# EAGLE design peregrine (EAGLE 6.2)
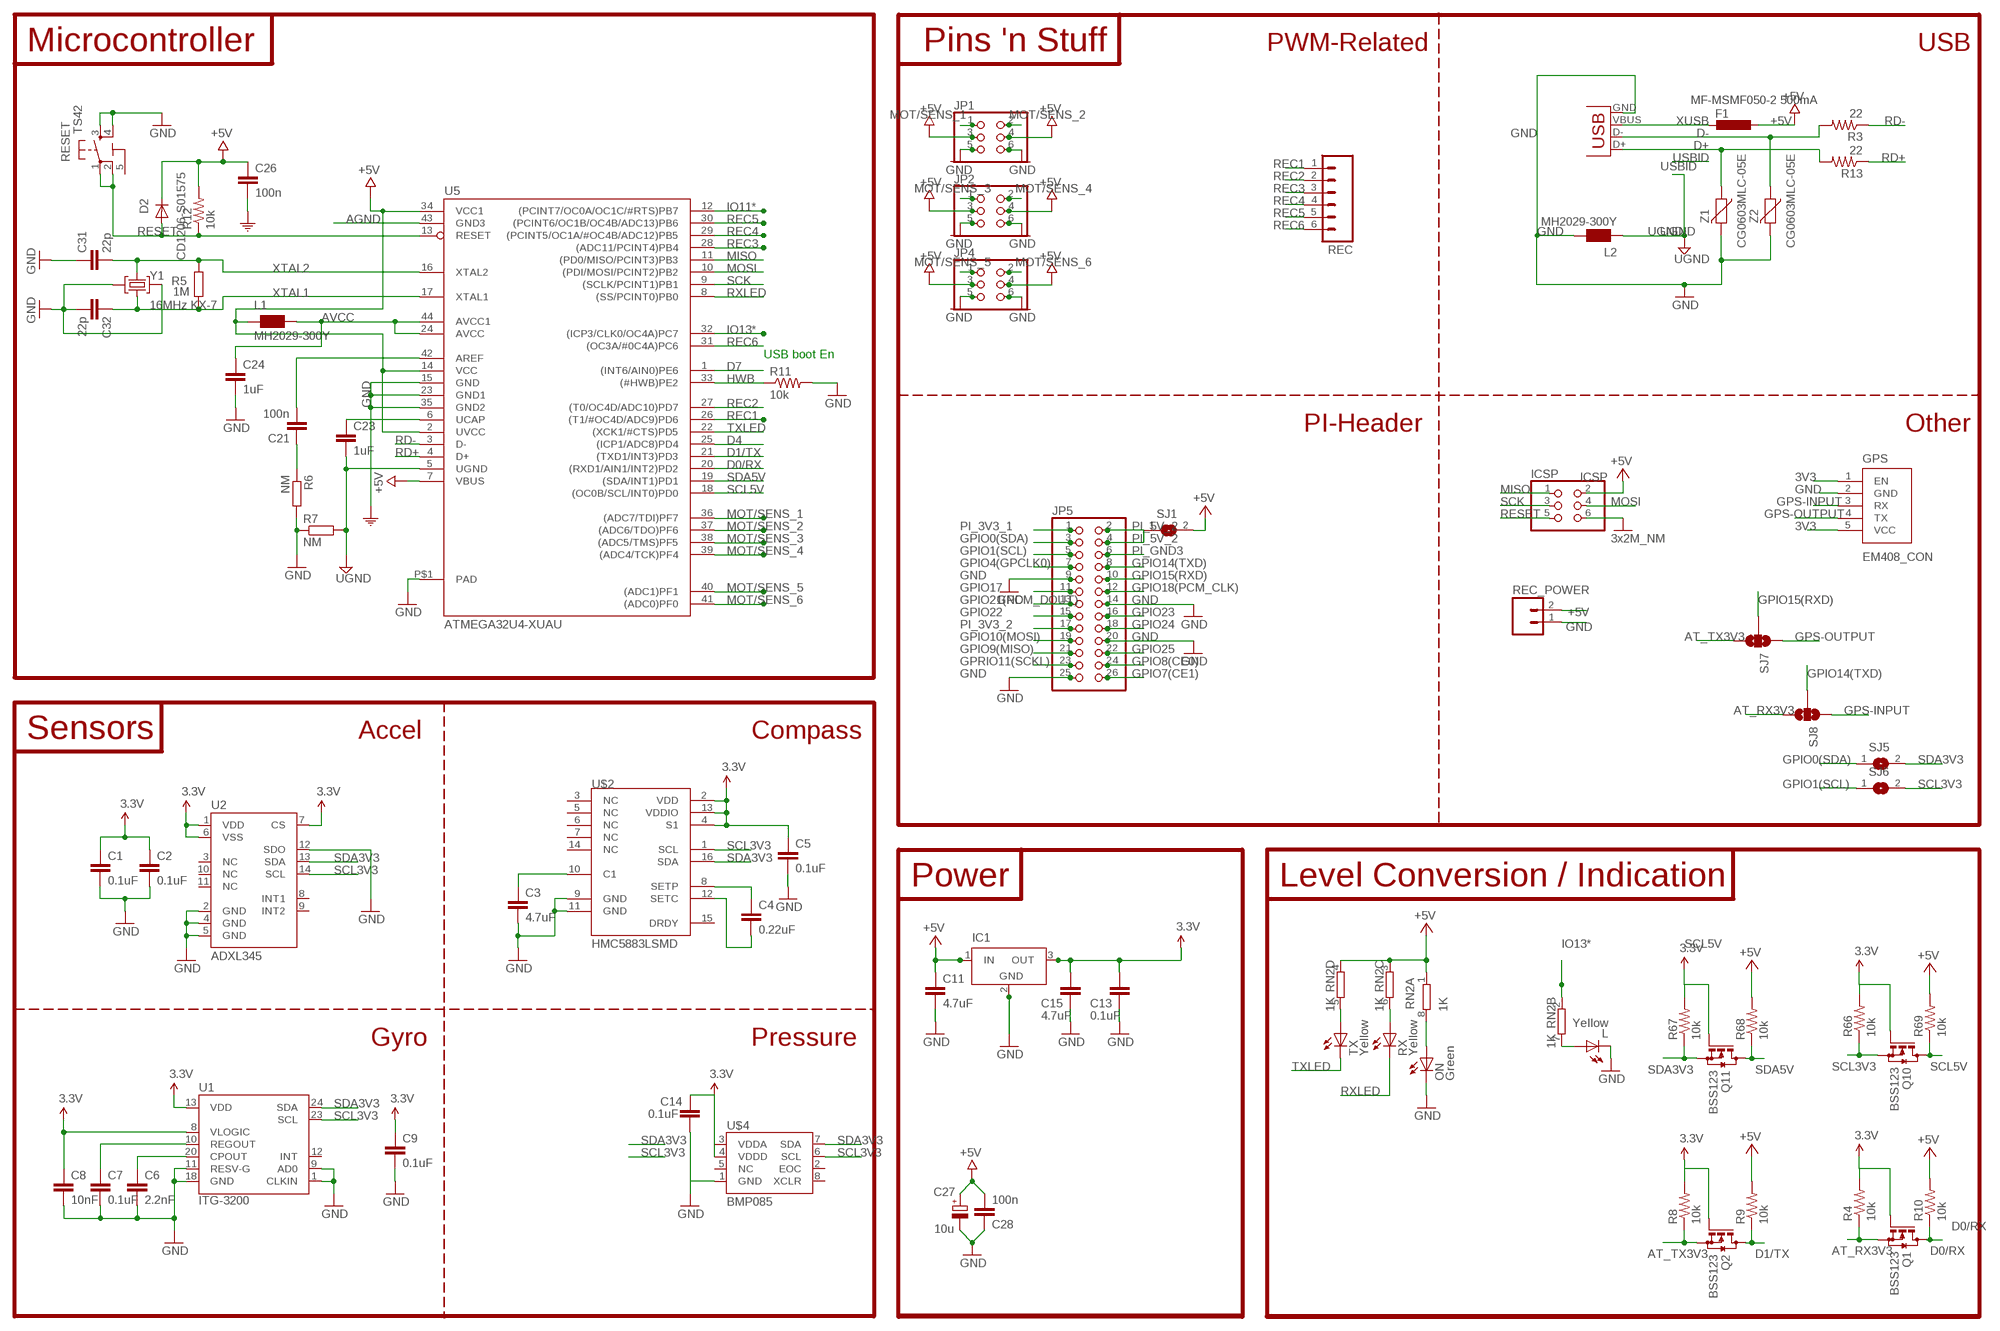
[diagram p0: schematic, sheet 1]

## Parts
C1  0.1uF  CAP0402-CAP  [0402-CAP]
C2  0.1uF  CAP0402-CAP  [0402-CAP]
C3  4.7uF  CAP0402-CAP  [0402-CAP]
C4  0.22uF  CAP0402-CAP  [0402-CAP]
C5  0.1uF  CAP0402-CAP  [0402-CAP]
C6  2.2nF  CAP0402-CAP  [0402-CAP]
C7  0.1uF  CAP0402-CAP  [0402-CAP]
C8  10nF  CAP0402-CAP  [0402-CAP]
C9  0.1uF  CAP0402-CAP  [0402-CAP]
C11  4.7uF  CAP0402-CAP  [0402-CAP]
C13  0.1uF  CAP0402-CAP  [0402-CAP]
C14  0.1uF  CAP0402-CAP  [0402-CAP]
C15  4.7uF  CAP0402-CAP  [0402-CAP]
C21  100n  C-EUC0603  [C0603-ROUND]
C23  1uF  C-EUC0603  [C0603-ROUND]
C24  1uF  C-EUC0603  [C0603-ROUND]
C26  100n  C-EUC0603  [C0603-ROUND]
C27  10u  CPOL-EUSMCB  [SMC_B]
C28  100n  C-EUC0603  [C0603-ROUND]
C31  22p  C-EUC0603  [C0603-ROUND]
C32  22p  C-EUC0603  [C0603-ROUND]
D2  CD1206-S01575  DIODE-MINIMELF  [MINIMELF]
F1  MF-MSMF050-2 500mA  L-EUL1812  [L1812]
GPS  EM408_CON  [EM408_CON]
IC1  LT1129CST5  [SOT223]
ICSP  ICSP  PINHD-2X3  [2X03]
JP1  PINHD-2X3  [2X03]
JP2  PINHD-2X3  [2X03]
JP4  PINHD-2X3  [2X03]
JP5  PINHD-2X13  [2X13]
L  Yellow  LEDCHIPLED_0805  [CHIPLED_0805]
L1  MH2029-300Y  WE-CBF_0805  [0805]
L2  MH2029-300Y  WE-CBF_0805  [0805]
ON  Green  LEDCHIPLED_0805  [CHIPLED_0805]
Q1  BSS123  [SOT23]
Q2  BSS123  [SOT23]
Q10  BSS123  [SOT23]
Q11  BSS123  [SOT23]
R3  22  RESISTOR0603-RES  [0603-RES]
R4  10k  RESISTOR0603-RES  [0603-RES]
R5  1M  R-EU_R0603  [R0603-ROUND]
R6  NM  R-EU_R0603  [R0603-ROUND]
R7  NM  R-EU_R0603  [R0603-ROUND]
R8  10k  RESISTOR0603-RES  [0603-RES]
R9  10k  RESISTOR0603-RES  [0603-RES]
R10  10k  RESISTOR0603-RES  [0603-RES]
R11  10k  R-US_R0603  [R0603]
R12  10k  R-US_R0603  [R0603]
R13  22  RESISTOR0603-RES  [0603-RES]
R66  10k  RESISTOR0603-RES  [0603-RES]
R67  10k  RESISTOR0603-RES  [0603-RES]
R68  10k  RESISTOR0603-RES  [0603-RES]
R69  10k  RESISTOR0603-RES  [0603-RES]
REC  M06SIP  [1X06]
REC_POWER  M02PTH  [1X02]
RESET  TS42  [TS42]
RN2  1K  4R-NCAY16  [CAY16]
RX  Yellow  LEDCHIPLED_0805  [CHIPLED_0805]
SJ1  SJ  [SJ]
SJ5  SJ  [SJ]
SJ6  SJ  [SJ]
SJ7  SOLDERJUMPER_2WAYS  [SJ_3]
SJ8  SOLDERJUMPER_2WAYS  [SJ_3]
TX  Yellow  LEDCHIPLED_0805  [CHIPLED_0805]
U1  ITG-3200  [QFN-24]
U2  ADXL345  [LGA14]
U5  ATMEGA32U4-XUAU  [TQFP44-PAD]
U$2  HMC5883LSMD  [16LPCC]
U$4  BMP085  [BMP085]
X2  USB-MICROB  [USB-MICROB]
Y1  16MHz KX-7  CRYSTAL-3.2-2.5  [CRYSTAL-3.2-2.5]
Z1  CG0603MLC-05E  VARISTORCN0603  [CT/CN0603]
Z2  CG0603MLC-05E  VARISTORCN0603  [CT/CN0603]

## Nets
3V3: C1.1 C2.1 C5.1 C8.1 C9.1 C13.1 C14.1 C15.1 GPS.1(EN) GPS.5(VCC) IC1.3(OUT) Q1.1(G) Q2.1(G) Q10.1(G) Q11.1(G) R4.2 R8.2 R66.2 R67.2 U1.8(VLOGIC) U1.13(VDD) U2.1(VDD) U2.6(VSS) U2.7(CS) U$2.2(VDD) U$2.4(S1) U$2.13(VDDIO) U$4.3(VDDA) U$4.4(VDDD) ; supply symbol labelled 3.3V
+5V: C11.1 C26.1 C27.+ C28.2 D2.C F1.1 IC1.1(IN) ICSP.2 JP1.3 JP1.4 JP2.3 JP2.4 JP4.3 JP4.4 L1.1 R9.2 R10.2 R12.2 R68.2 R69.2 REC_POWER.2 RN2.1 RN2.3 RN2.4 SJ1.2 U5.2(UVCC) U5.7(VBUS) U5.14(VCC) U5.34(VCC1)
AGND: C21.1 R6.1 U5.43(GND3)
AREF: C21.2 U5.42(AREF)
AT_RX3V3: Q1.2(S) R4.1 SJ8.3
AT_TX3V3: Q2.2(S) R8.1 SJ7.3
AVCC: C24.1 L1.2 U5.24(AVCC) U5.44(AVCC1)
D0/RX: Q1.3(D) R10.1 U5.20((RXD1/AIN1/INT2)PD2)
D1/TX: Q2.3(D) R9.1 U5.21((TXD1/INT3)PD3)
D4: U5.25((ICP1/ADC8)PD4)
D7: U5.1((INT6/AIN0)PE6)
D+: R13.2 X2.D+ Z1.1
D-: R3.2 X2.D- Z2.1
GND: C1.2 C2.2 C3.2 C5.2 C6.2 C7.2 C8.2 C9.2 C11.2 C13.2 C14.2 C15.2 C24.2 C26.2 C27.- C28.1 C31.1 C32.2 GPS.2(GND) IC1.2(GND) ICSP.6 JP1.5 JP1.6 JP2.5 JP2.6 JP4.5 JP4.6 JP5.9 JP5.14 JP5.20 JP5.25 L2.2 L.C ON.C R6.2 R7.1 R11.2 REC_POWER.1 RESET.3 RESET.4 U1.1(CLKIN) U1.9(AD0) U1.11(RESV-G) U1.18(GND) U2.2(GND) U2.4(GND) U2.5(GND) U2.12(SDO) U5.15(GND) U5.23(GND1) U5.35(GND2) U5.P$1(PAD) U$2.9(GND) U$2.11(GND) U$4.1(GND) X2.GND Y1.2(GND) Y1.4(GND) Z1.2 Z2.2 ; supply symbol labelled 3x2M_NM, COM
GPIO0(SDA): JP5.3 SJ5.1
GPIO1(SCL): JP5.5 SJ6.1
GPIO4(GPCLK0): JP5.7
GPIO7(CE1): JP5.26
GPIO8(CE0): JP5.24
GPIO9(MISO): JP5.21
GPIO10(MOSI): JP5.19
GPIO14(TXD): JP5.8 SJ8.2
GPIO15(RXD): JP5.10 SJ7.2
GPIO17: JP5.11
GPIO18(PCM_CLK): JP5.12
GPIO21(PCM_DOUT): JP5.13
GPIO22: JP5.15
GPIO23: JP5.16
GPIO24: JP5.18
GPIO25: JP5.22
GPRIO11(SCKL): JP5.23
GPS-INPUT: GPS.3(RX) SJ8.1
GPS-OUTPUT: GPS.4(TX) SJ7.1
HWB: R11.1 U5.33((#HWB)PE2)
IO11*: U5.12((PCINT7/OC0A/OC1C/#RTS)PB7)
IO13*: RN2.2 U5.32((ICP3/CLK0/OC4A)PC7)
MISO: ICSP.1 U5.11((PD0/MISO/PCINT3)PB3)
MOSI: ICSP.4 U5.10((PDI/MOSI/PCINT2)PB2)
MOT/SENS_1: JP1.1 U5.36((ADC7/TDI)PF7)
MOT/SENS_2: JP1.2 U5.37((ADC6/TDO)PF6)
MOT/SENS_3: JP2.1 U5.38((ADC5/TMS)PF5)
MOT/SENS_4: JP2.2 U5.39((ADC4/TCK)PF4)
MOT/SENS_5: JP4.1 U5.40((ADC1)PF1)
MOT/SENS_6: JP4.2 U5.41((ADC0)PF0)
N$1: C3.1 U$2.10(C1)
N$2: C4.1 U$2.8(SETP)
N$3: C4.2 U$2.12(SETC)
N$4: RN2.5 TX.A
N$5: C6.1 U1.20(CPOUT)
N$7: C7.1 U1.10(REGOUT)
N$8: ON.A RN2.8
N$9: L.A RN2.7
N$10: RN2.6 RX.A
PI_3V3_1: JP5.1
PI_3V3_2: JP5.17
PI_5V_2: JP5.2 JP5.4 SJ1.1
PI_GND3: JP5.6
RD+: R13.1 U5.4(D+)
RD-: R3.1 U5.3(D-)
REC1: REC.1 U5.26((T1/#OC4D/ADC9)PD6)
REC2: REC.2 U5.27((T0/OC4D/ADC10)PD7)
REC3: REC.3 U5.28((ADC11/PCINT4)PB4)
REC4: REC.4 U5.29((PCINT5/OC1A/#OC4B/ADC12)PB5)
REC5: REC.5 U5.30((PCINT6/OC1B/OC4B/ADC13)PB6)
REC6: REC.6 U5.31((OC3A/#0C4A)PC6)
RESET: D2.A ICSP.5 R12.1 RESET.1 RESET.2 U5.13(RESET)
RXLED: RX.C U5.8((SS/PCINT0)PB0)
SCK: ICSP.3 U5.9((SCLK/PCINT1)PB1)
SCL3V3: Q10.2(S) R66.1 SJ6.2 U1.23(SCL) U2.14(SCL) U$2.1(SCL) U$4.6(SCL)
SCL5V: Q10.3(D) R69.1 U5.18((OC0B/SCL/INT0)PD0)
SDA3V3: Q11.2(S) R67.1 SJ5.2 U1.24(SDA) U2.13(SDA) U$2.16(SDA) U$4.7(SDA)
SDA5V: Q11.3(D) R68.1 U5.19((SDA/INT1)PD1)
TXLED: TX.C U5.22((XCK1/#CTS)PD5)
UCAP: C23.1 U5.6(UCAP)
UGND [gnd]: C23.2 L2.1 R7.2 U5.5(UGND)
XTAL1: C32.1 R5.1 U5.17(XTAL1) Y1.1(C1)
XTAL2: C31.2 R5.2 U5.16(XTAL2) Y1.3(C2)
XUSB [usbvcc]: F1.2 X2.VBUS
Unconnected: U1.12(INT) U2.3(NC) U2.8(INT1) U2.9(INT2) U2.10(NC) U2.11(NC) U$2.3(NC) U$2.5(NC) U$2.6(NC) U$2.7(NC) U$2.14(NC) U$2.15(DRDY) U$4.2(EOC) U$4.5(NC) U$4.8(XCLR)

## Notes on the sheet
- Microcontroller | Pins 'n Stuff | PWM-Related | USB
- USB boot En
- PI-Header | Other
- Sensors | Accel | Compass
- Power | Level Conversion / Indication
- Gyro | Pressure

## Power pins joined to a net without a drawn wire
5-GND: RESET.5(5-GND)
GND: IC1.4(GND)

## Library data of the parts
C1-C9 C11 C13-C15 = SparkFun:CAP: Capacitor Standard 0603 ceramic capacitor, and 0.1" leaded capacitor.
C21 C23 C24 C26 C28 C31 C32 = SmartPrj:C-EU: CAPACITOR, European symbol
C27 = rcl:CPOL-EU: POLARIZED CAPACITOR, European symbol
D2 = diode:DIODE-: DIODE
F1 = rcl:L-EU: INDUCTOR, European symbol
GPS = SparkFun:EM408_CON: This is the mating connector for the EM408 GPS receiver. The EM408 connects to the board via a cable, this connector footprint does not include the outline of the receiver. You should include the "EM408_Outline" device in your schematic if you are to use the EM408 in your design.
IC1 = linear-technology:LT1129CST5: VOLTAGE REGULATOR with shutdown; MPN: LT1129CST-5#PBF; OC_FARNELL: 1663375; OC_NEWARK: 57M2069
ICSP = SmartPrj:PINHD-2X3: PIN HEADER
JP1 JP2 JP4 = pinhead:PINHD-2X3: PIN HEADER
JP5 = pinhead:PINHD-2X13: PIN HEADER
L ON RX TX = led:LED: LED OSRAM: - CHIPLED LG R971, LG N971, LY N971, LG Q971, LY Q971, LO R971, LY R971 LH N974, LH R974 LS Q976, LO Q976, LY Q976 LO Q996 - Hyper CHIPLED LW Q18S LB Q993, LB Q99A, LB R99A - SideLED LS A670, LO A670, LY A670, LG A670, LP A670 LB A673, LV A673, LT A673, LW A673 LH A674 LY A675 LS A676, LA A676, LO A676, LY A676, LW A676 LS A679, LY A679, LG A679 - Hyper Micro SIDELED® LS Y876, LA Y876, LO Y876, LY Y876 LT Y87S - SmartLED LW L88C, LW L88S LB L89C, LB L89S, LG L890 LS L89K, LO L89K, LY L89K LS L896, LA L896, LO L896, LY L896 - TOPLED LS T670, LO T670, LY T670, LG T670, LP T670 LSG T670, LSP T670, LSY T670, LOP T670, LYG T670 LG T671, LOG T671, LSG T671 LB T673, LV T673, LT T673, LW T673 LH T674 LS T676, LA T676, LO T676, LY T676, LB T676, LH T676, LSB T676, LW T676 LB T67C, LV T67C, LT T67C, LS T67K, LO T67K, LY T67K, LW E67C LS E67B, LA E67B, LO E67B, LY E67B, LB E67C, LV E67C, LT E67C LW T67C LS T679, LY T679, LG T679 LS T770, LO T770, LY T770, LG T770, LP T770 LB T773, LV T773, LT T773, LW T773 LH T774 LS E675, LA E675, LY E675, LS T675 LS T776, LA T776, LO T776, LY T776, LB T776 LHGB T686 LT T68C, LB T68C - Hyper Mini TOPLED® LB M676 - Mini TOPLED Santana® LG M470 LS M47K, LO M47K, LY M47K Source: http://www.osram.convergy.de LUXEON: - LUMILED® LXK2-PW12-R00, LXK2-PW12-S00, LXK2-PW14-U00, LXK2-PW14-V00 LXK2-PM12-R00, LXK2-PM12-S00, LXK2-PM14-U00 LXK2-PE12-Q00, LXK2-PE12-R00, LXK2-PE12-S00, LXK2-PE14-T00, LXK2-PE14-U00 LXK2-PB12-K00, LXK2-PB12-L00, LXK2-PB12-M00, LXK2-PB14-N00, LXK2-PB14-P00, LXK2-PB14-Q00 LXK2-PR12-L00, LXK2-PR12-M00, LXK2-PR14-Q00, LXK2-PR14-R00 LXK2-PD12-Q00, LXK2-PD12-R00, LXK2-PD12-S00 LXK2-PH12-R00, LXK2-PH12-S00 LXK2-PL12-P00, LXK2-PL12-Q00, LXK2-PL12-R00 Source: www.luxeon.com KINGBRIGHT: KA-3528ASYC Source: www.kingbright.com
L1 L2 = wuerth-elektronik:WE-CBF: SMD EMI Suppression Ferrite Beads - excellent anti-EMI properties - low DCR - impedances till 3000 ohms - rated current up to 6 A
Q1 Q2 Q10 Q11 = transistor-small-signal:BSS123: N-CHANNEL MOS FET
R3 R4 R8-R10 R13 R66-R69 = SparkFun:RESISTOR: Resistor Basic schematic elements and footprints for 0603, 1206, and PTH resistors.
R5-R7 = SmartPrj:R-EU_: RESISTOR, European symbol
R11 R12 = resistor:R-US_: RESISTOR, American symbol
REC = SparkFun:M06: Header 6 Standard 6-pin 0.1" header. Use with straight break away headers (SKU : PRT-00116), right angle break away headers (PRT-00553), swiss pins (PRT-00743), machine pins (PRT-00117), and female headers (PRT-00115). Molex polarized connector foot print use with SKU : PRT-08094 with associated crimp pins and housings. NOTES ON THE VARIANTS LOCK and LOCK_LONGPADS... This footprint was designed to help hold the alignment of a through-hole component (i.e. 6-pin header) while soldering it into place. You may notice that each hole has been shifted either up or down by 0.005 of an inch from it's more standard position (which is a perfectly straight line). This slight alteration caused the pins (the squares in the middle) to touch the edges of the holes. Because they are alternating, it causes a "brace" to hold the component in place. 0.005 has proven to be the perfect amount of "off-center" position when using our standard breakaway headers. Although looks a little odd when you look at the bare footprint, once you have a header in there, the alteration is very hard to notice. Also, if you push a header all the way into place, it is covered up entirely on the bottom side. This idea of altering the position of holes to aid alignment will be further integrated into the Sparkfun Library for other footprints. It can help hold any component with 3 or more connection pins.
REC_POWER = SparkFun:M02: Header 2 Standard 2-pin 0.1" header. Use with straight break away headers (SKU : PRT-00116), right angle break away headers (PRT-00553), swiss pins (PRT-00743), machine pins (PRT-00117), and female headers (PRT-00115). Molex polarized connector foot print use with SKU : PRT-08233 with associated crimp pins and housings.
RESET = SmartPrj:TS42: TS42 Dongnan Electronics Tact switch VDC 12V - 50mA
RN2 = resistor-dil:4R-N: Array Chip Resistor Source: RS Component / Phycomp
SJ1 SJ5 SJ6 = jumper:SJ: SMD solder JUMPER
SJ7 SJ8 = SparkFun:SOLDERJUMPER_2WAY: Solder Jumper 2 way solder jumper
U1 = SparkFun:ITG-3200: ITG-3200 3-axis gyro, digital output, qfn24 package
U2 = SparkFun:ADXL345
U5 = SmartPrj:ATMEGA32U4-XU
U$2 = SparkFun:HMC5883L: 3 Axis Digital Compass IC
U$4 = SparkFun:BMP085: BMP085 Pressure Sensor Great little MEMS pressure sensor. SKU: COM-09603
X2 = SparkFun:USB: USB Connectors USB-B-PTH is fully proven SKU : PRT-00139 USB-miniB is fully proven SKU : PRT-00587 USB-A-PCB is untested. USB-A-H is throughly reviewed, but untested. Spark Fun Electronics SKU : PRT-00437 USB-B-SMT is throughly reviewed, but untested. Needs silkscreen touching up. USB-A-S has not been used/tested USB-MB-H has not been used/tested
Y1 = SmartPrj:CRYSTAL-3.2-2.5
Z1 Z2 = varistor:VARISTOR: VARISTOR

## Net classes
0 default: width 0.203 mm, drill 0.406 mm, clearance 0.152 mm
1 power: width 0.203 mm, drill 0.508 mm, clearance 0.152 mm
2 gnd: width 0.254 mm, drill 0.61 mm, clearance 0.254 mm
3 usbvcc: width 0.203 mm, drill 0.508 mm, clearance 0.152 mm
4 aref: width 0.254 mm, drill 0.61 mm, clearance 0.254 mm

## Board
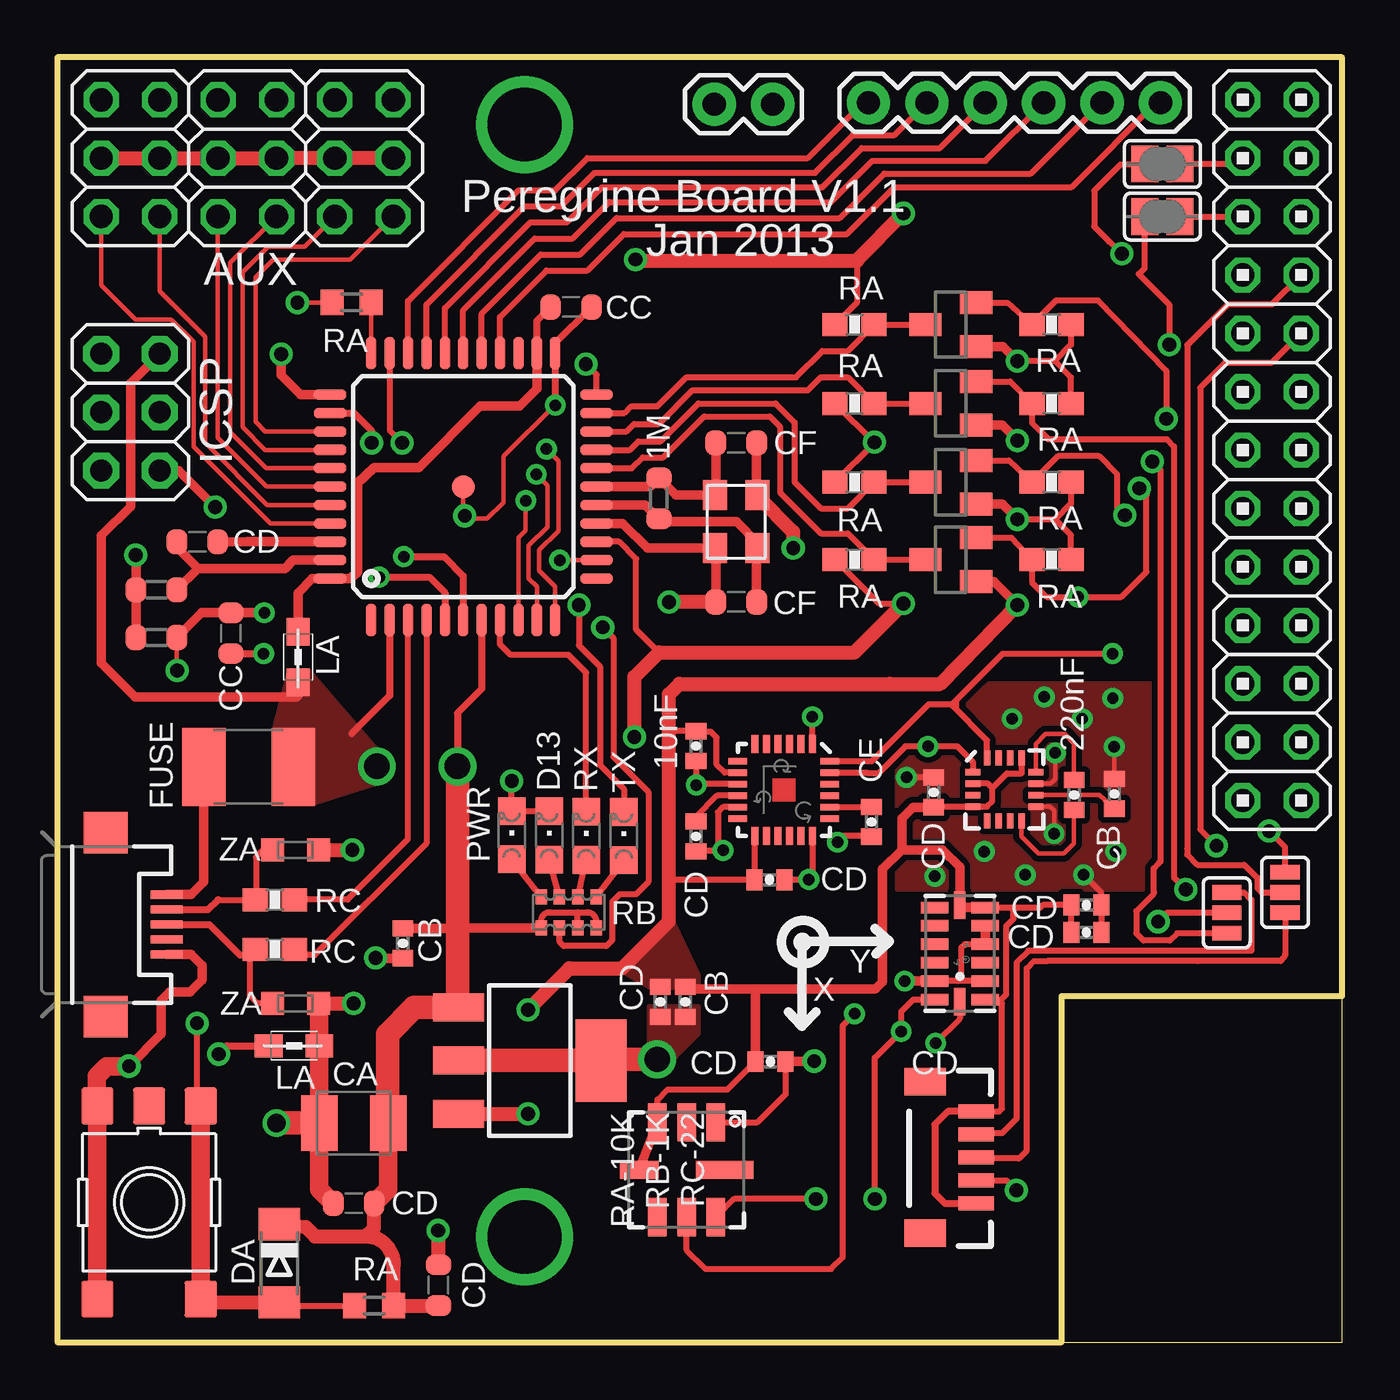
[diagram p1: board, top side]
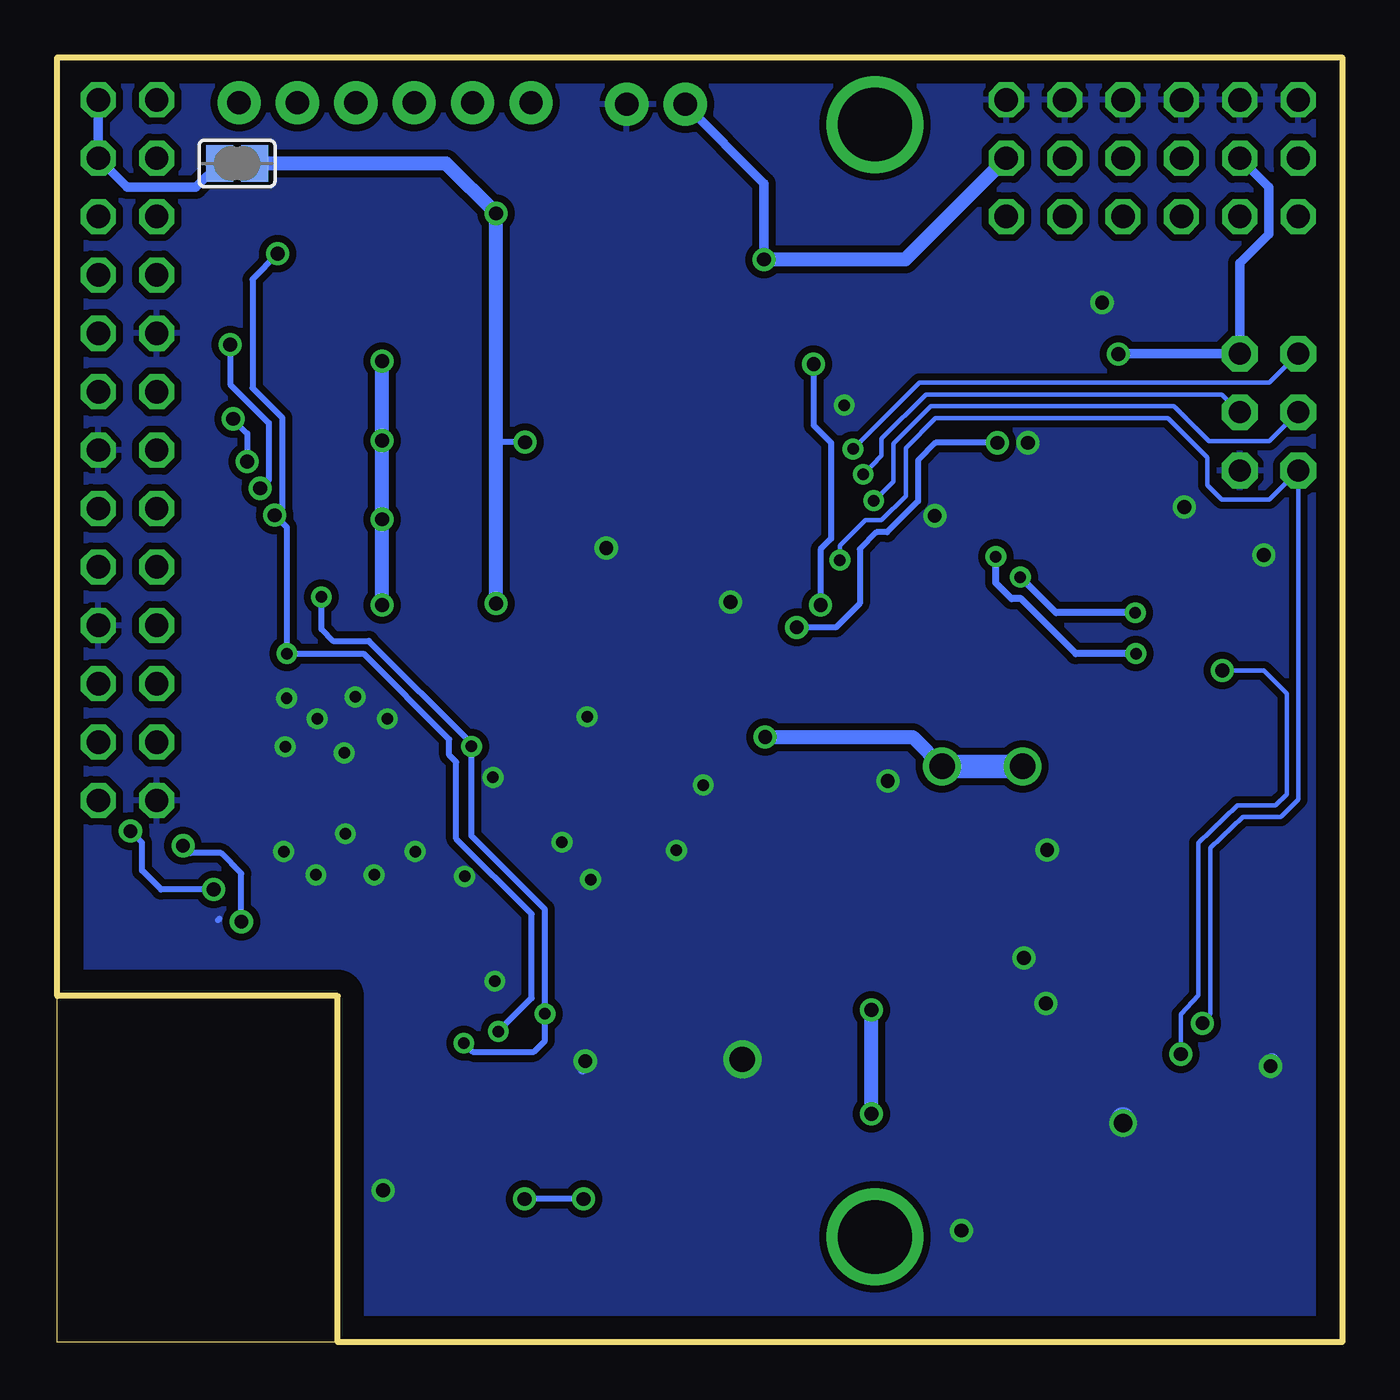
[diagram p2: board, bottom side, seen from below]

Size 55.88 x 55.88 mm. Coordinates in mm from the lower left corner, seen from the top.
Outline: 55.88,15.05 55.88,0 43.69,0
Outline: 43.69,0 0,0 0,55.88 55.88,55.88 55.88,15.05
Outline: 43.69,0 43.69,15.05 55.88,15.05
Copper layers (1*16): Top 0.035mm / dielectric 1.5mm / Bottom 0.035mm
Design rules: minimum track width 6mil, minimum drill 15mil, track to track 6mil, track to pad 6mil, pad to pad 6mil, via to via 6mil, smd to smd 6mil, copper to edge 40mil, drill to drill 8mil, minimum pad ring 10mil, minimum via ring 8mil, stop-mask expansion 4mil, vias tented up to drill 24mil, thermal gap 10mil

### Footprints (pad centres in the part's own frame; a part is rotated, then mirrored left to right if it is on the bottom)
0402-CAP = smd 0.7 x 0.9: 1 -0.65,0; 2 0.65,0
C0603-ROUND = smd 0.898 x 1.1: 1 -0.889,0; 2 0.889,0
SMC_B = smd 1.6 x 2.4: + -1.5,0; - 1.5,0
MINIMELF = smd 1.4 x 1.8: A 1.7,0; C -1.7,0
L1812 = smd 1.9 x 3.4: 1 -1.95,0; 2 1.95,0
EM408_CON = smd 0.6 x 1.55: 1 4,0; 2 3,0; 3 2,0; 4 1,0; 5 0,0 | smd 1.2 x 1.8: P$1 -1.3,-2.225; P$2 5.3,-2.225
SOT223 = smd 1.219 x 2.235: 1 -2.311,-3.099; 2 0,-3.099; 3 2.311,-3.099 | smd 3.6 x 2.2: 4 0,3.099
2X03 = drill 0.95 pad 1.55 octagon: 1 -2.54,-1.27; 2 -2.54,1.27; 3 0,-1.27; 4 0,1.27; 5 2.54,-1.27; 6 2.54,1.27
2X03' = drill 1.016 octagon: 1 -2.54,-1.27; 2 -2.54,1.27; 3 0,-1.27; 4 0,1.27; 5 2.54,-1.27; 6 2.54,1.27
2X13 = drill 1.016 octagon: 1 -15.24,-1.27; 2 -15.24,1.27; 3 -12.7,-1.27; 4 -12.7,1.27; 5 -10.16,-1.27; 6 -10.16,1.27; 7 -7.62,-1.27; 8 -7.62,1.27; 9 -5.08,-1.27; 10 -5.08,1.27; 11 -2.54,-1.27; 12 -2.54,1.27; 13 0,-1.27; 14 0,1.27; 15 2.54,-1.27; 16 2.54,1.27; 17 5.08,-1.27; 18 5.08,1.27; 19 7.62,-1.27; 20 7.62,1.27; 21 10.16,-1.27; 22 10.16,1.27; 23 12.7,-1.27; 24 12.7,1.27; 25 15.24,-1.27; 26 15.24,1.27
CHIPLED_0805 = smd 1.2 x 1.2: A 0,-1.05; C 0,1.05
0805 = smd 1.2 x 1: 1 -1.1,0; 2 1.1,0
SOT23 = smd 1 x 1.4: 1 -0.95,-1.1; 2 0.95,-1.1; 3 0,1.1
0603-RES = smd 1.1 x 1: 1 -0.85,0; 2 0.85,0
R0603-ROUND = smd 0.898 x 1.1: 1 -0.889,0; 2 0.889,0
R0603 = smd 1 x 1.1: 1 -0.85,0; 2 0.85,0
1X06 = drill 1.016 pad 1.88: 1 0,0; 2 2.54,0; 3 5.08,0; 4 7.62,0; 5 10.16,0; 6 12.7,0
1X02 = drill 1.016 pad 1.88: 1 0,0; 2 2.54,0
TS42 = smd 1.6 x 1.4: 1 -4.2,2.25; 2 4.2,2.25; 3 -4.2,-2.25; 4 4.2,-2.25; 5 -4.2,0
CAY16 = smd 0.5 x 0.65: 1 -1.2,-0.675; 2 -0.4,-0.675; 3 0.4,-0.675; 4 1.2,-0.675; 5 1.2,0.675; 6 0.4,0.675; 7 -0.4,0.675; 8 -1.2,0.675
SJ = smd 1.168 x 1.6: 1 -0.762,0; 2 0.762,0
SJ_3 = smd 0.635 x 1.27: 1 -0.889,0; 2 0,0; 3 0.889,0
QFN-24 = smd 0.8 x 0.3: 1 -2,1.25; 2 -2,0.75; 3 -2,0.25; 4 -2,-0.25; 5 -2,-0.75; 6 -2,-1.25; 13 2,-1.25; 14 2,-0.75; 15 2,-0.25; 16 2,0.25; 17 2,0.75; 18 2,1.25 | smd 0.3 x 0.8: 7 -1.25,-2; 8 -0.75,-2; 9 -0.25,-2; 10 0.25,-2; 11 0.75,-2; 12 1.25,-2; 19 1.25,2; 20 0.75,2; 21 0.25,2; 22 -0.25,2; 23 -0.75,2; 24 -1.25,2
LGA14 = smd 0.5 x 1.2: 1 2,1.1; 2 1.2,1.1; 3 0.4,1.1; 4 -0.4,1.1; 5 -1.2,1.1; 6 -2,1.1; 8 -2,-1.1; 9 -1.2,-1.1; 10 -0.4,-1.1; 11 0.4,-1.1; 12 1.2,-1.1; 13 2,-1.1 | smd 1.2 x 0.5: 7 -2.1,0; 14 2.1,0
TQFP44-PAD = smd 1.4 x 0.45: 1 -5.8,4; 2 -5.8,3.2; 3 -5.8,2.4; 4 -5.8,1.6; 5 -5.8,0.8; 6 -5.8,0; 7 -5.8,-0.8; 8 -5.8,-1.6; 9 -5.8,-2.4; 10 -5.8,-3.2; 11 -5.8,-4; 23 5.8,-4; 24 5.8,-3.2; 25 5.8,-2.4; 26 5.8,-1.6; 27 5.8,-0.8; 28 5.8,0; 29 5.8,0.8; 30 5.8,1.6; 31 5.8,2.4; 32 5.8,3.2; 33 5.8,4 | smd 0.45 x 1.4: 12 -4,-5.8; 13 -3.2,-5.8; 14 -2.4,-5.8; 15 -1.6,-5.8; 16 -0.8,-5.8; 17 0,-5.8; 18 0.8,-5.8; 19 1.6,-5.8; 20 2.4,-5.8; 21 3.2,-5.8; 22 4,-5.8; 34 4,5.8; 35 3.2,5.8; 36 2.4,5.8; 37 1.6,5.8; 38 0.8,5.8; 39 0,5.8; 40 -0.8,5.8; 41 -1.6,5.8; 42 -2.4,5.8; 43 -3.2,5.8; 44 -4,5.8 | smd 1 x 1: P$1 0,0
16LPCC = smd 0.65 x 0.28: 1 -1.37,0.75; 2 -1.37,0.25; 3 -1.37,-0.25; 4 -1.37,-0.75; 9 1.37,-0.75; 10 1.37,-0.25; 11 1.37,0.25; 12 1.37,0.75 | smd 0.28 x 0.65: 5 -0.75,-1.37; 6 -0.25,-1.37; 7 0.25,-1.37; 8 0.75,-1.37; 13 0.75,1.37; 14 0.25,1.37; 15 -0.25,1.37; 16 -0.75,1.37
BMP085 = smd 1.67 x 0.8: 1 -2.065,1.27; 2 -2.065,0; 3 -2.065,-1.27; 5 2.065,-1.27; 6 2.065,0; 7 2.065,1.27 | smd 0.8 x 1.67: 4 0,-2.065 | smd 0.8 x 2.5: 8 0,1.65
USB-MICROB = smd 0.35 x 1.4: D+ 0,2.65; D- -0.65,2.65; GND 1.3,2.65; ID 0.65,2.65; VBUS -1.3,2.65 | smd 1.8 x 1.9: MT1 -4,0; MT2 4,0
CRYSTAL-3.2-2.5 = smd 1.3 x 1.05: 1 -1.15,-0.925; 2 1.15,-0.925; 3 1.15,0.925; 4 -1.15,0.925
CT/CN0603 = smd 1 x 1: 1 -1,0; 2 1,0

### Placement (x,y rotation side)
C1  44.75,17.82 0 top
C2  44.75,19.01 0 top
C3  45.97,23.85 90 top
C4  44.22,23.8 90 top
C5  38.11,23.91 90 top
C6  35.41,22.63 270 top
C7  27.77,22 270 top
C8  27.77,25.92 270 top
C9  30.98,20.1 0 top
C11  15.02,17.35 270 top
C13  26.23,14.8 270 top
C14  31.01,12.2 0 top
C15  27.3,14.8 270 top
C21  6.08,34.81 0 top
C23  7.54,30.84 90 top
C24  22.34,45.02 0 top
C26  16.57,2.48 90 top
C27  12.89,9.53 180 top
C28  12.89,6.03 0 top
C31  29.53,32.19 0 top
C32  29.53,39.12 0 top
D2  9.65,3.43 270 top
F1  8.32,25.02 180 top
GPS  39.97,10.03 270 top
IC1  20.55,12.24 270 top
ICSP  3.17,40.45 270 top
JP1  [2X03']  13.34,51.5 90 top
JP2  [2X03']  8.26,51.5 90 top
JP4  [2X03']  3.17,51.5 90 top
JP5  52.83,38.8 270 top
L  21.39,22.03 0 top
L1  10.46,29.79 90 top
L2  10.29,12.89 0 top
ON  19.76,22.05 0 top
Q1  38.86,40.83 90 top
Q2  38.86,44.26 90 top
Q10  38.86,34.04 90 top
Q11  38.86,37.4 90 top
R3  9.46,19.24 180 top
R4  43.24,40.83 0 top
R5  26.16,36.7 270 top
R6  4.31,32.73 180 top
R7  4.31,30.65 0 top
R8  43.24,44.26 0 top
R9  34.67,44.26 180 top
R10  34.67,40.83 180 top
R11  12.8,45.22 180 top
R12  13.78,1.59 0 top
R13  9.46,17.08 180 top
R66  43.24,34.04 0 top
R67  43.24,37.4 0 top
R68  34.67,37.4 180 top
R69  34.67,34.04 180 top
REC  47.98,53.91 180 top
REC_POWER  31.11,53.85 180 top
RESET  3.99,6.07 270 top
RN2  22.24,18.69 0 top
RX  23,22.02 0 top
SJ1  48.07,51.27 0 bottom
SJ5  48.07,51.24 180 top
SJ6  48.07,48.96 180 top
SJ7  50.86,18.67 270 top
SJ8  53.4,19.56 90 top
TX  24.64,22.01 0 top
U1  31.6,24.02 270 top
U2  39.26,16.9 270 top
U5  17.65,37.21 90 top
U$2  41.19,24.04 0 top
U$4  27.37,7.49 270 top
X2  2.1,18.16 270 top
Y1  29.53,35.69 270 top
Z1  10.35,14.73 0 top
Z2  10.35,21.4 0 top

### Tracks (layer width: path | path; a pad name or v marks a point on that pad's centre or on a via)
3V3  (via drill 0.6)
  Top 0.254: R8.2 44.09,43.38 43.38,42.67 | 43.38,42.67 v41.76,42.67 | R4.2 44.09,41.96 43.38,42.67 | R66.2 44.09,35.1 43.41,35.79 | 43.41,35.79 v41.76,35.79 | R67.2 44.09,36.47 43.41,35.79 | U1.8 29.03,24.77 28.68,25.12 28.68,26.29 28.42,26.54 27.8,26.54 C8.1 26.62,26.57 26.59,26.54 | 26.59,20.02 arc-90 26.68,20.1 C9.1 30.35,20.13 U1.13 | C5.1 38.14,23.29 U$2.4 40.44,23.29 40.66,23.52 40.66,24.11 | 36.14,28.57 36.2,28.63 | 40.66,24.11 40.48,24.29 U$2.2 | U$2.13 41.94,24.74 41.3,24.74 40.66,24.11 | 39.36,18.9 U2.7 | U2.6 41.47,18.9 | 41.47,18.9 42.76,18.9 42.87,19.01 C2.1 C1.1 | U2.1 40.89,14.9 | 40.89,14.9 41.07,14.9 41.27,15.11 41.27,18.1 41.59,18.41 41.59,18.78 41.47,18.9 | U$4.3 26.1,10.54 26.54,10.99 29.14,10.99 C14.1 | GPS.5 40.96,10.03 41.08,10.16 41.08,14.71 40.89,14.9
  Top 0.305: GPS.5 38.73,10.03 38.16,9.46 38.16,6.48 38.61,6.03 GPS.1
  Top 0.406: Q10.1 40.73,33.09 v41.76,32.05 | Q11.1 41.09,36.45 v41.76,35.79 | Q1.1 41.09,39.88 v41.76,39.22 | Q2.1 41.12,43.31 v41.76,42.67 | U$4.4 U$4.3 | C14.1 30.36,14.29 30.36,15.36 30.35,15.37 | C5.1 37.21,23.26 36.73,22.78 36.73,21.41 | 36.73,21.41 35.89,20.57 35.89,15.67 35.59,15.37 31.09,15.37 30.35,15.37 | U2.7 39.26,20.66 38.51,21.41 36.73,21.41 | 39.36,18.9 U2.6 | 30.35,15.37 27.38,15.37 C15.1
  Top 0.61: IC1.3 v20.47,9.93 | v20.47,14.45 22.28,16.26 24.56,16.26 26.59,18.29 26.59,20.02 26.59,26.54 26.59,28.17 27.05,28.63 36.2,28.63 38.41,28.63 v41.76,32.05
  Bottom 0.61: v20.47,9.93 v20.47,14.45 | v41.76,32.05 v41.76,35.79 v41.76,39.22 v41.76,42.67
  pour Top (no thermals): 25.73,15.42 24.38,16.21 26.37,18.24 26.8,18.24 27.89,15.95 27.89,15.42
+5V  (via drill 0.6, 1.1)
  Top 0.254: 22.63,18.69 21.41,18.69 arc90 21.04,18.32 RN2.1 | 22.63,18.69 23.04,18.69 arc-90 23.44,18.29 RN2.4 | RN2.3 arc-90 RN2.3 22.63,18.69 | 26.16,30 25.17,30.99 25.17,34.06 24.42,34.81 U5.14 | R69.2 35.73,32.13 v36.8,32.13 | R68.2 35.53,39.12 v35.53,39.14 35.51,39.14 R10.2 | R9.2 34.8,45.24 34.8,47.04 34.8,47.09
  Top 0.305: U5.7 18.45,28.41 17.4,27.36 v17.4,25.04 | U5.2 14.45,28.12 12.8,26.47
  Top 0.406: U5.34 10.58,41.21 9.73,42.06 v9.73,42.98 | ICSP.2 4.45,42.98 3.17,41.71 3.17,36.35 1.91,35.08 1.91,29.54 3.38,28.07 10.41,28.07 10.46,28.12 | RN2.1 17.49,18.02 arc90 17.4,17.93 | C11.1 17.34,18 17.4,18.06
  Top 0.61: JP4.4 JP4.3 JP2.4 JP2.3 9.54,51.51 14.66,51.51 14.64,51.5 JP1.4 | D2.C 10.8,5 11.2,4.6 13.41,4.6 | 13.41,4.6 13.77,4.95 13.77,6.02 C28.2 | 13.41,4.6 arc-90 14.63,3.38 R12.2 C26.1 | v25.09,26.31 25.09,28.93 26.16,30 34.67,30 v36.8,32.13 | v25.15,47.09 25.2,47.04 34.8,47.04 | 34.8,47.09 v36.8,49.1
  Top 0.813: C27.+ 14.39,6.64 C28.2 | F1.1 10.29,25.04 arc90 10.46,25.32
  Top 1.016: C27.+ 14.35,9.56 14.35,13.39 15.52,14.55 IC1.1 17.4,14.61 17.4,17.93 17.4,18.06 v17.4,25.04
  Bottom 0.254: v35.53,39.14 36.8,39.14
  Bottom 0.406: JP4.3 3.17,50.23 3.17,48.2 4.45,46.93 ICSP.2 9.72,42.99 v9.73,42.98 | v25.15,47.09 25.15,50.39 REC_POWER.2
  Bottom 0.61: v25.09,26.31 18.67,26.31 v17.4,25.04 | v36.8,32.13 36.8,39.14 v36.8,49.1 38.98,51.27 SJ1.2 | JP1.3 19.01,47.09 v25.15,47.09
  Bottom 1.016: v13.89,25.04 v17.4,25.04
  pour Top (no thermals): 13.89,24.31 11.2,23.44 10.39,25.07 9.42,26.67 10.08,29.18 10.95,29.18 13.89,25.78
AGND
  Top 0.406: R6.1 6.12,33.66 | 6.12,33.66 9.91,33.66 10.26,34.01 U5.43 | C21.1 5.19,34.58 6.12,33.66
AREF
  Top 0.406: C21.2 8.24,34.81 U5.42
AT_RX3V3  (via drill 0.6)
  Top 0.254: Q1.2 41.44,41.78 R4.1 42.39,39.98 43.1,39.27 48.26,39.27 48.56,38.96 48.56,20.52 48.56,20.21 v49.09,19.68 | 52.58,22.23 v52.7,22.23 53.4,21.53 SJ8.3
  Bottom 0.254: v49.09,19.68 51.37,19.68 52.2,20.51 52.2,21.72 v52.7,22.23
AT_TX3V3  (via drill 0.6)
  Top 0.254: Q2.2 41.32,45.21 R8.1 43.45,45.31 45.26,45.31 48.23,42.27 v48.23,40.16 | v47.62,38.3 47.98,37.95 47.98,20.9 47.89,20.82 47.69,20.61 47.69,19.62 47.69,19.49 46.93,18.73 46.93,17.78 47.24,17.46 48.39,17.46 48.7,17.78 SJ7.3
  Bottom 0.254: v48.23,40.16 47.62,39.52 v47.62,38.3
AVCC
  Top 0.305: U5.24 20.85,44.42 C24.1
  Top 0.406: L1.2 10.46,32.59 11.09,33.21 U5.44 12.74,33.21 13.06,33.5 13.06,37.36 13.77,38.05 15.72,38.05 18.39,40.72 20.09,40.72 20.85,41.48 U5.24
D0/RX
  Top 0.254: U5.20 24.75,39.61 25.08,39.94 26.16,39.94 27.62,41.4 32.64,41.4 33.21,41.97 34.38,41.97 R10.1 Q1.3
D1/TX
  Top 0.254: U5.21 24.66,40.41 24.96,40.7 26.1,40.7 27.37,41.97 32.13,41.97 33.27,43.12 34.38,43.12 R9.1 Q2.3
D+
  Top 0.254: 7.93,16.83 8.36,16.83 R13.2 8.38,16.85 8.38,15.05 8.69,14.74 Z1.1
  Top 0.305: X2.D+ 6.6,18.16 7.93,16.83
  Top 0.406: Z1.1
D-
  Top 0.254: 6.99,19.24 R3.2 8.64,19.27 8.64,21.08 8.95,21.4 Z2.1
  Top 0.305: X2.D- 6.56,18.81 6.99,19.24 6.99,19.23
GND  (via drill 0.5, 0.6, 0.8, 1.1)
  Top 0.203: R11.2 10.45,45.23 v10.44,45.21 | U$2.9 43.18,23.29 43.36,23.11 v43.36,22.11 | U$2.11 43.21,24.29 43.41,24.49 v43.41,25.63 | C3.2 v45.97,25.89 | 17.84,35.81 18.69,35.81 19.41,36.52 19.41,38.53 21.61,40.74 | U5.P$1 17.65,36.01 v17.72,35.94 | v17.72,35.94 17.84,35.81 | 17.84,35.81 v17.72,35.94
  Top 0.254: L.C 21.37,23.1 ON.C v19.76,24.41 | C8.2 27.77,24.35 v27.79,24.23 27.86,24.27 U1.9 | C7.2 27.82,21.39 v28.96,21.39 28.73,21.61 28.73,23.04 28.95,23.27 U1.11 | C9.2 31.64,20.12 v32.69,20.12 arc90 32.85,20.27 U1.18 | C6.2 arc90 35.37,22.02 34.21,22.02 v33.93,21.74 | U1.1 v32.85,27.2 arc90 v32.84,27.2 | C5.2 37.03,24.56 v36.93,24.56 | C1.2 C2.2 45.41,19.56 v44.64,20.32 | U2.2 39.18,15.7 | 39.18,15.7 U2.12 | U2.4 39.47,17.3 39.31,17.14 39.31,15.83 39.18,15.7 | U$4.1 30.45,9.56 31.69,10.79 31.69,12.18 C14.2 | GPS.2 41.29,7.03 v41.72,6.6
  Top 0.305: U5.35 12.9,40.41 13.66,39.65 v13.66,39.12 | v21.65,40.75 U5.23 21.65,43.45 C24.2
  Top 0.406: U5.15 24.59,35.61 25.66,34.54 Y1.2 28.64,34.5 C31.1 | Y1.4 30.42,36.87 C32.2 | R7.1 R6.2 3.42,34.23 v3.4,34.24 | ICSP.6 5.27,37.91 v6.86,36.32 | C11.2 13.86,16.7 v13.84,16.71 | C14.2 32.91,12.21 v32.92,12.22 32.89,12.19 | U2.4 U2.5 | U2.12 36.91,15.7 arc90 v36.85,15.7 | X2.GND 5.81,16.86 6.29,16.38 6.29,15.75 5.78,15.24 4.89,15.24 4.51,14.86 4.51,13.4 v3.11,12
  Top 0.61: C31.1 v26.61,32.19 | Y1.4 30.45,36.79 32,35.24 v32,34.54 | Z2.2 12.81,21.4 arc90 v12.83,21.41 | Z1.2 v12.88,14.73 | C26.2 16.57,4.84 arc90 v16.56,4.85
  Top 0.813: Z1.2 11.39,14.7 L2.2 C27.- 11.39,6.64 C28.1 | RESET.4 RESET.3 1.71,11.57 2.15,12 v3.11,12
  Top 1.016: L2.2 | C27.- v9.53,9.53 | IC1.2 IC1.4 23.7,12.29 v26.09,12.29
  Bottom 0.203: v10.44,45.21 10.44,45.16 | v43.36,22.11 43.41,22.05 | v43.41,25.63 43.46,25.63 | v45.97,25.89 45.77,25.7 | v21.65,40.75 21.61,40.72 | v17.72,35.94 17.72,35.88 17.53,35.69
  Bottom 0.254: 48.9,18.35 48.83,18.41 | v19.76,24.41 19.84,24.33 | v27.79,24.23 27.79,23.98 27.76,24.05 | v28.96,21.39 28.98,21.36 28.98,21.34 | v32.69,20.12 32.69,20.04 | v32.84,27.2 32.97,27.2 arc-90 32.99,27.18 | v33.93,21.74 33.93,21.64 | v36.93,24.56 37.03,24.64 | v41.72,6.6 41.72,6.54
  Bottom 0.305: v13.66,39.12 13.79,39.12
  Bottom 0.406: v3.4,34.24 3.48,34.24 3.5,34.21 | v6.86,36.32 6.73,36.32 6.71,36.3 | v13.84,16.71 13.59,16.71 | v32.92,12.22 32.92,11.96 33.05,11.84 | v36.85,15.7 36.91,15.67
  Bottom 0.61: v3.11,12 3.11,12.19 3.05,12.26 | v26.61,32.19 26.54,32.19 arc-90 26.48,32.26 | v32,34.54 31.88,34.54 | v12.83,21.41 12.83,21.51 arc-90 12.85,21.54 | v12.88,14.73 12.95,14.81 arc-90 12.98,14.83 | v16.56,4.85 16.41,4.85
  Bottom 1.016: v9.53,9.53 9.53,9.72 | v26.09,12.29 26.06,12.27 26.06,12.22
  other vias: 45.91,28 46.04,21.34 38.16,20.26 44.58,27.11 40.32,21.34 42.1,20.32 41.53,27.11 42.93,28.07
  pour Bottom (isolate 0.305): 0,0 55.88,0 55.88,55.88 0,55.88
  pour Top (no thermals): 25.7,12.34 25.73,12.37 25.73,14.61 27.89,14.61 27.89,13.41 26.82,12.34
  pour Top (isolate 0.254, no thermals): 36.51,28.64 47.82,28.64 47.82,19.68 36.51,19.68
GPIO0(SDA)
  Top 0.254: JP5.3 51.31,51.24 SJ5.1
GPIO1(SCL)
  Top 0.254: SJ6.1 JP5.5
GPIO14(TXD)
  Top 0.254: JP5.8 52.83,45.15 50.93,45.15 49.15,43.37 49.15,21.46 49.15,21.21 49.59,20.77 51.63,20.77 52.2,20.19 52.2,19.75 52.39,19.56 SJ8.2 53.09,19.43
GPIO15(RXD)  (via drill 0.6)
  Top 0.254: JP5.10 52.83,42.61 50.8,42.61 49.71,41.52 49.71,22.3 v50.42,21.59 | SJ7.2 48.26,18.67 v47.88,18.29
  Bottom 0.254: v47.88,18.29 47.88,20.38 48.77,21.27 50.1,21.27 v50.42,21.59
GPS-INPUT
  Top 0.254: GPS.3 40,8 41.78,8 41.85,8 42.16,8.32 42.16,10.41 42.16,15.37 42.16,16.26 42.48,16.57 43.05,16.57 49.59,16.57 53.21,16.57 53.4,16.83 53.4,16.89 SJ8.1
GPS-OUTPUT
  Top 0.254: SJ7.1 51.63,19.56 51.94,19.24 51.94,17.02 43.05,17.02 42.93,17.02 42.23,17.02 41.72,16.51 41.72,13.46 41.72,9.72 41.08,9.08 40.01,9.08 GPS.4
HWB
  Top 0.203: U5.33 R11.1
IO13*  (via drill 0.6)
  Top 0.254: U5.32 14.45,39.65 v14.99,39.12 | v23.72,31.09 24.18,30.63 24.18,25.45 25.7,23.93 25.7,20.02 25.17,19.48 24.46,19.48 24.13,19.15 24.13,17.48 23.88,17.22 22.02,17.22 21.84,17.4 RN2.2
  Bottom 0.254: v23.72,31.09 22.02,31.09 20.98,32.13 20.98,34.49 20.24,35.23 19.79,35.23 18.44,36.58 18.44,38.35 17.68,39.12 v14.99,39.12
MISO  (via drill 0.5)
  Top 0.203: U5.11 21.65,32.85 20.95,33.55 20.95,34.44 21.79,35.28 21.79,38.33 v21.27,38.85
  Bottom 0.203: ICSP.1 3.16,41.73 18.39,41.73 v21.27,38.85
MOSI  (via drill 0.5)
  Top 0.203: U5.10 20.85,32.87 20.5,33.22 20.5,34.65 21.31,35.46 21.31,37.26 v20.83,37.74
  Bottom 0.203: ICSP.4 5.22,41.22 18.11,41.22 20.04,39.29 20.04,38.56 v20.83,37.74
MOT/SENS_1
  Top 0.203: U5.36 9.03,39.61 8.61,40.03 8.61,46.33 9.37,47.09 12.74,47.09 JP1.1
MOT/SENS_2
  Top 0.203: U5.37 9.04,38.81 8.05,39.8 8.05,46.53 9.17,47.65 10.76,47.65 JP1.2
MOT/SENS_3
  Top 0.203: U5.38 9.08,38.01 7.52,39.57 7.52,46.95 JP2.1
MOT/SENS_4
  Top 0.203: U5.39 9.09,37.21 6.96,39.34 6.96,48.93 JP2.2
MOT/SENS_5
  Top 0.203: U5.40 9.13,36.41 6.43,39.12 6.43,43.74 4.45,45.72 JP4.1
MOT/SENS_6
  Top 0.203: JP4.2 1.91,45.97 3.4,44.48 4.95,44.48 5.92,43.51 5.92,38.96 9.27,35.61 U5.41
N$1
  Top 0.203: U$2.10 45.32,23.79 C3.1
N$2
  Top 0.203: U$2.8 41.94,22 42.67,21.26 43.79,21.26 44.22,21.69 C4.1
N$3
  Top 0.203: U$2.12 42.56,26.02 42.98,26.44 43.81,26.44 44.22,26.04 C4.2
N$4
  Top 0.254: 24.64,20.62 TX.A RN2.5
N$5
  Top 0.254: U1.20 35.39,23.27 arc90 C6.1
N$6  (via drill 3.2)
  other vias: 20.32,4.57
N$7
  Top 0.254: U1.10 28.69,23.77 27.77,22.85 C7.1
N$8
  Top 0.254: RN2.8 ON.A
N$9
  Top 0.254: RN2.7 L.A
N$10
  Top 0.254: RN2.6 RX.A
N$11
  Top 0.203: 39.12,27.62 39.12,27.88
N$14  (via drill 3.2)
  other vias: 20.32,52.96
PI_5V_2
  Bottom 0.406: SJ1.1 49.86,50.24 52.84,50.24 JP5.4 JP5.2
RD+
  Top 0.254: U5.4 16.05,21.69 11.2,16.83 10.56,16.83 R13.1
RD-
  Top 0.254: U5.3 15.25,21.88 12.62,19.25 10.32,19.25 R3.1
REC1
  Top 0.254: U5.26 19.25,44.59 21.27,46.61 23.05,46.61 24.64,48.2 34.35,48.2 36.4,50.24 44.12,50.24 47.79,53.91 REC.1
REC2
  Top 0.254: U5.27 18.45,44.74 21.02,47.31 22.73,47.31 24.32,48.9 34.04,48.9 35.97,50.83 42.35,50.83 REC.2
REC3
  Top 0.254: U5.28 17.65,44.9 20.77,48.01 22.42,48.01 24,49.59 33.66,49.59 35.45,51.38 40.37,51.38 REC.3
REC4
  Top 0.254: U5.29 16.85,44.98 20.57,48.7 22.16,48.7 23.69,50.23 33.27,50.23 34.99,51.94 38.39,51.94 REC.4
REC5
  Top 0.254: U5.30 16.05,45.14 20.32,49.4 21.91,49.4 23.37,50.86 32.96,50.86 34.59,52.5 36.41,52.5 REC.5
REC6
  Top 0.254: U5.31 15.25,45.29 20.07,50.1 21.65,50.1 23.05,51.5 32.64,51.5 35.05,53.91 REC.6
RESET  (via drill 0.5, 0.6)
  Top 0.203: U5.13 v21.84,34.01 | v21.84,34.01 | 6.06,13.86 v6.07,13.87
  Top 0.254: D2.A 9.67,1.59 R12.1 | RESET.1 6.07,10.36 v6.07,13.87
  Top 0.61: 6.1,1.6 6.23,1.73 D2.A
  Top 0.813: 6.1,1.6 RESET.2 RESET.1
  Bottom 0.203: v6.07,13.87 5.74,14.28 5.74,21.49 4.32,22.84 2.67,22.84 1.91,23.6 ICSP.5 3.16,36.65 5.23,36.65 5.87,37.29 5.87,38.48 7.57,40.18 17.68,40.18 18.97,38.89 18.97,36.8 20.04,35.76 20.73,35.76 21.84,34.65 v21.84,34.01
RXLED
  Top 0.254: RX.C 23,29.12 22.23,29.9 19.71,29.9 19.25,30.35 U5.8
SCK  (via drill 0.5)
  Top 0.203: U5.9 20.05,34.99 20.37,35.31 v20.37,36.6
  Bottom 0.203: ICSP.3 3.16,39.19 5.79,39.19 7.32,40.72 17.88,40.72 19.51,39.09 19.51,37.44 20.34,36.6 v20.37,36.6
SCL3V3  (via drill 0.5, 0.6)
  Top 0.254: Q10.2 41.51,34.99 R66.1 42.39,33.04 43.03,32.41 v44.4,32.41 46.28,32.41 47.37,33.5 47.37,36.83 v47.07,37.13 | SJ6.2 47.3,48.95 47.3,46.71 47.04,46.46 48.36,45.14 v48.36,43.38 | U1.23 35.23,24.77 35.74,24.77 36.88,25.91 v37.87,25.91 39.14,25.91 39.82,25.23 U$2.1 | U2.14 39.26,14.06 v38.2,13.01 | U$4.6 27.37,4 28.19,3.17 33.66,3.17 34.16,3.68 34.16,13.77 v34.67,14.28
  Bottom 0.254: v48.36,43.38 48.36,41.66 46.69,39.98 46.69,37.52 v47.07,37.13 | v44.4,32.41 44.4,31.01 43.89,30.5 42.34,30.5 37.87,26.04 v37.87,25.91 37.87,22.02 34.67,18.82 v34.67,14.28 34.67,13.11 35.15,12.62 37.82,12.62 v38.2,13.01
SCL5V
  Top 0.254: U5.18 24.99,38.01 25.46,38.48 26.35,38.48 28.13,40.26 30.99,40.26 31.43,39.81 31.43,36.96 33.21,35.18 34.38,35.18 R69.1 Q10.3
SDA3V3  (via drill 0.5, 0.6)
  Top 0.254: Q11.2 41.38,38.35 R67.1 43.52,38.53 45.31,38.53 46.1,37.74 46.1,36.3 v46.43,35.97 | SJ5.2 47.3,51.23 46.25,51.23 45.1,50.08 45.1,48.52 45.76,47.87 v46.3,47.35 | U1.24 35.43,25.27 37.91,27.75 38.92,27.75 | U2.13 37.23,14.9 36.7,14.38 v36.7,13.51 35.56,12.37 v35.56,6.22 | 38.92,27.75 41.12,29.95 v45.9,29.95 | U$2.16 40.44,26.18 38.92,27.69 38.92,27.75 | v32.99,6.22 29.43,6.22 U$4.7
  Bottom 0.254: v46.3,47.35 47.4,46.23 47.4,41.5 46.1,40.21 46.1,36.3 v46.43,35.97 45.9,35.43 v45.9,29.95 42.57,29.95 38.84,26.21 38.84,25.53 38.53,25.22 38.53,21.89 35.26,18.62 35.26,14.96 v36.7,13.51 | v32.99,6.22 v35.56,6.22
SDA5V
  Top 0.254: U5.19 24.9,38.81 25.27,39.18 26.23,39.18 27.88,40.83 31.24,40.83 32.07,40.01 32.07,37.4 33.21,36.26 34.38,36.26 R68.1 Q11.3
TXLED  (via drill 0.6)
  Top 0.254: U5.22 23.45,42.08 v22.99,42.55 | v22.68,32.05 22.68,30.3 23.6,29.39 23.6,25.09 24.64,24.05 TX.C
  Bottom 0.254: v22.99,42.55 22.99,39.88 22.23,39.12 22.23,34.95 22.68,34.49 v22.68,32.05
UCAP  (via drill 0.5)
  Top 0.305: C23.1 v8.97,29.95 | v15.06,34.16 16.82,34.16 17.65,33.33 U5.6
  Bottom 0.305: v8.97,29.95 11.58,29.95 13.97,32.33 14.38,32.33 15.06,33.02 v15.06,34.16
UGND  (via drill 0.5, 0.6)
  Top 0.203: R7.2 5.19,29.22 v5.21,29.21
  Top 0.305: v13.99,33.27 16.18,33.27 16.85,32.6 U5.5 | v7.01,12.52 7.38,12.89 L2.1
  Top 0.406: R7.2 6.27,31.73 C23.2 v8.99,31.73
  Bottom 0.203: v5.21,29.21 3.4,29.21 2.41,28.22 2.41,23.82 2.9,23.34 4.55,23.34 6.25,21.72 6.25,15.09 7.01,14.25 v7.01,12.52
  Bottom 0.305: v8.99,31.73 12.45,31.73 v13.99,33.27
XTAL1
  Top 0.406: U5.17 25.78,37.21 R5.1 26.92,36.84 Y1.1 28.64,36.87 C32.1
XTAL2
  Top 0.406: U5.16 25.57,36.41 R5.2 26.29,35.69 29.53,35.69 30.45,34.76 Y1.3 30.42,34.5 C31.2
XUSB
  Top 0.406: X2.VBUS 5.81,19.46 6.37,20.02 F1.2

### Text on the board
tNames: Peregrine Board V1.1 | Jan 2013 | AUX | CC | RA | RA | RA | RA | CF | RA | ICSP | 1M | CD | RA | RA | CF | RA | RA | LA | 10nF | FUSE | CC | 220nF | D13 | RX | TX | CE | ZA | PWR | CD | CB | CD | RC | RC | RB | CD | CD | CD | CB | Y | ZA | X | CD | CB | CD | CD | LA | CA | RA-10K / RB-1K / RC-22 | CD | CD | RA | DA